# EasyEDA Pro project 灯板.eprj

# Schematic Schematic1
Create Date: 2024-07-11; Page Name: P1; Project Name: 灯板; Schematic Name: Schematic1; Update Date: 2024-07-11; Company: 嘉立创EDA; Page Size: A4; Version: V1.0
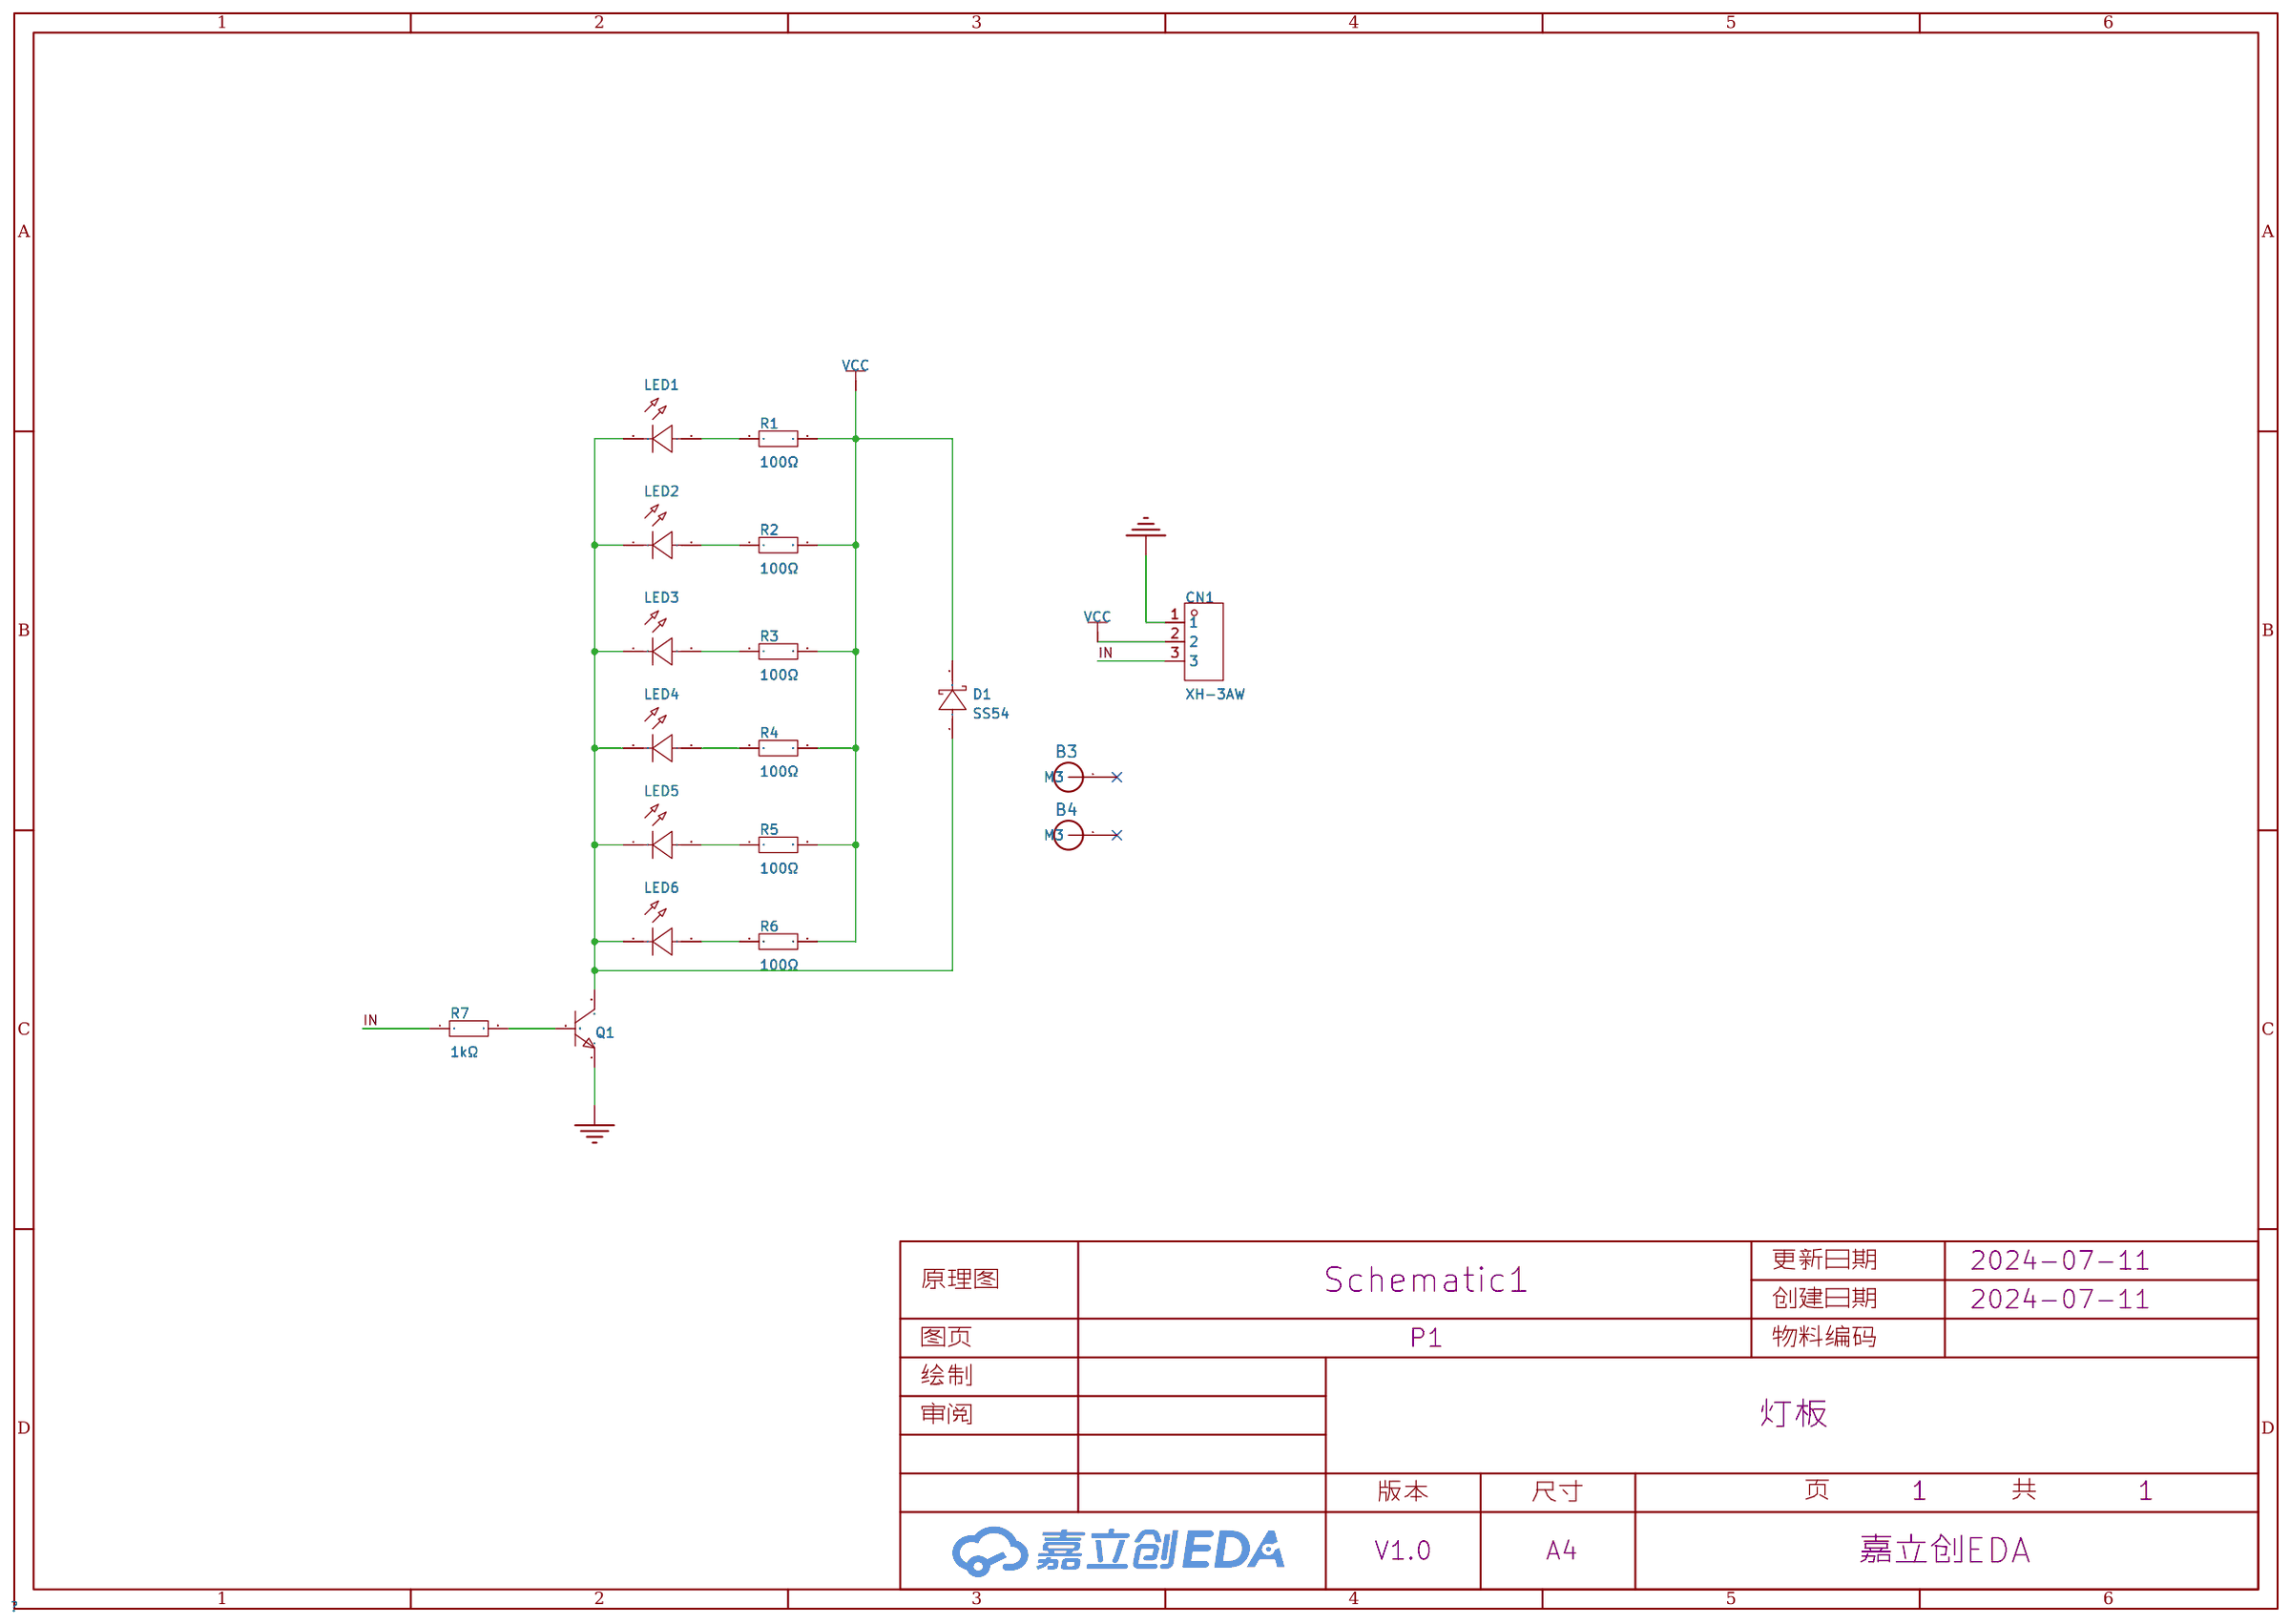
[diagram p0: schematic sheet]

## Parts
B3  M3螺柱孔_JX  [M3]
B4  M3螺柱孔_JX  [M3]
CN1  XH-3AW  [CONN-TH_3P-P2.54_HCTL_XH-3AW]
D1  SS54  [SMA_L4.3-W2.6-LS5.0-FD]
LED1  HL-A-3528H343W-S1-13HL-HR3(SDCM  [LED-SMD_L3.2-W2.8-LS3.5-RD_WHITE]
LED2  HL-A-3528H343W-S1-13HL-HR3(SDCM  [LED-SMD_L3.2-W2.8-LS3.5-RD_WHITE]
LED3  HL-A-3528H343W-S1-13HL-HR3(SDCM  [LED-SMD_L3.2-W2.8-LS3.5-RD_WHITE]
LED4  HL-A-3528H343W-S1-13HL-HR3(SDCM  [LED-SMD_L3.2-W2.8-LS3.5-RD_WHITE]
LED5  HL-A-3528H343W-S1-13HL-HR3(SDCM  [LED-SMD_L3.2-W2.8-LS3.5-RD_WHITE]
LED6  HL-A-3528H343W-S1-13HL-HR3(SDCM  [LED-SMD_L3.2-W2.8-LS3.5-RD_WHITE]
Q1  PBSS4350X,115  [SOT-89-3_L4.5-W2.5-P1.50-LS4.0-TR]
R1  100Ω  [R0603]
R2  100Ω  [R0603]
R3  100Ω  [R0603]
R4  100Ω  [R0603]
R5  100Ω  [R0603]
R6  100Ω  [R0603]
R7  1kΩ  [R0603]

## Library data of the parts
B3 B4 = M3螺柱孔_JX
CN1 = XH-3AW_C2908612: 插针结构:1x3P;间距:2.54mm;安装方式:弯插;参考系列:XH;总PIN数:3P;排数:1;每排PIN数:3;行距:-;额定电流:3A;触头材质:黄铜;触头镀层:锡;工作温度范围:-25℃~+85℃;; LCSC Part Name: 1x3P 间距:2.54mm 弯插 系列:XH; Supplier Part: C2908612; Manufacturer: HCTL(华灿天禄); Supplier Footprint: 弯插,P=2.54mm; JLCPCB Part Class: 扩展库; Datasheet: https://atta.szlcsc.com/upload/public/pdf/source/20230711/B565BAF3B11666EF6B81B3605408F2BD.pdf; Supplier: LCSC; Pins Structure: 1x3P; Pitch: 2.54mm; Mounting Style: 弯插; Reference Series: XH; Number of Pins: 3P; Number of Rows: 1; Number of PINs Per Row: 3; Current Rating (Max): 3A; Contact Material: 黄铜; Contact Plating: 锡; Operating Temperature Range: -25℃~+85℃
D1 = SS54_C7420369: 二极管配置:独立式;正向压降(Vf):550mV@5.0A;直流反向耐压(Vr):40V;平均整流电流(Io):5A;; LCSC Part Name: 电压:40V 电流:5A; Supplier Part: C7420369; Manufacturer: 宏迦橙; Supplier Footprint: SMA(DO-214AC); JLCPCB Part Class: 扩展库; Datasheet: https://atta.szlcsc.com/upload/public/pdf/source/20230828/254C3882F8647358AD9F60DD73611B5E.pdf; Supplier: LCSC; Diode Configuration: 独立式; Forward Voltage (Vf@If): 550mV@5.0A; Reverse Voltage (Vr): 40V; Average Rectified Current (Io): 5A; Reverse Leakage Current (Ir): 50uA@40V; Peak forward surge current: 120A
LED1-LED6 = HL-A-3528H343W-S1-13HL-HR3(SDCM_C516297: 发光颜色:白色;正向电压(VF):3.2V;功率:96mW;正向电流:20mA;主波长:-;透镜颜色:雾状黄透镜;色温:5000K;发光角度:120°;载带方式:正贴;工作温度:-40℃~+85℃;; LCSC Part Name: 白灯 正贴 色温5000K; Supplier Part: C516297; Manufacturer: HONGLITRONIC(鸿利光电); Supplier Footprint: SMD3528; JLCPCB Part Class: 扩展库; Datasheet: https://atta.szlcsc.com/upload/public/pdf/source/20200909/C516297_F1BF49F1CA56F4CAC6EC1E874BCCBE66.pdf; Supplier: LCSC; Emitted Color: 白色; Forward Voltage (VF): 3.2V; Power Dissipation: 96mW; Forward Current: 20mA; Lens Color: 雾状黄透镜; Color Temperature: 5000K; Viewing Angle: 120°; Mounting Sytle: 正贴; Operating Temperature: -40℃~+85℃
Q1 = PBSS4350X,115: 晶体管类型:NPN;集电极电流(Ic):3A;集射极击穿电压(Vceo):50V;功率(Pd):1.6W;直流电流增益(hFE@Ic,Vce):300@1A,2V;; LCSC Part Name: NPN 电流:3A 耐压:50V; Supplier Part: C135818; Manufacturer: Nexperia(安世); Supplier Footprint: SOT-89-3; JLCPCB Part Class: 扩展库; Datasheet: https://atta.szlcsc.com/upload/public/pdf/source/20200310/C493581_4E10D9A4C69822D153923FC65F749D7B.pdf; Supplier: LCSC; Transistor Type: NPN; Collector Current (Ic): 3A; Collector-Emitter Breakdown Voltage (Vceo): 50V; Power Dissipation (Pd): 1.6W; DC Current Gain (hFE@Ic,Vce): 300@1A,2V; Transition Frequency (fT): 100MHz; Collector Cut-Off Current (Icbo): 100nA; Collector-Emitter Saturation Voltage (VCE(sat)@Ic,Ib): 370mV@3A,300mA
R1-R6 = RC0603FR-07100RL: 电阻类型:厚膜电阻;阻值:100Ω;精度:±1%;功率:100mW;最大工作电压:75V;温度系数:±100ppm/℃;; LCSC Part Name: 厚膜电阻 100Ω ±1% 100mW; Supplier Part: C105588; Manufacturer: YAGEO(国巨); Supplier Footprint: 0603; JLCPCB Part Class: Extended Part; Datasheet: https://atta.szlcsc.com/upload/public/pdf/source/20180316/70C0E2BDAE7FCC62C531A5A58D202EE1.pdf; Supplier: LCSC; Type: 厚膜电阻; Tolerance: ±1%; Power(Watts): 100mW; Overload Voltage (Max): 75V; Temperature Coefficient: ±100ppm/℃; Operating Temperature Range: -55℃~+155℃
R7 = 0603WAF1001T5E: 电阻类型:厚膜电阻;阻值:1kΩ;精度:±1%;功率:100mW;; LCSC Part Name: 1kΩ ±1% 100mW; Supplier Part: C21190; Manufacturer: UNI-ROYAL(厚声); Supplier Footprint: 0603; JLCPCB Part Class: Basic Part; Datasheet: https://atta.szlcsc.com/upload/public/pdf/source/20200306/C422600_1E6D84923E4A46A82E41ADD87F860B5C.pdf; Supplier: LCSC; Type: 厚膜电阻; Tolerance: ±1%; Power(Watts): 100mW; Temperature Coefficient: ±100ppm/℃; Overload Voltage (Max): 75V; Operating Temperature Range: -55℃~+155℃

## Nets
GND: CN1.1 Q1.1(E)
VCC: CN1.2 D1.2(K) R1.2 R2.2 R3.2 R4.2 R5.2 R6.2
IN: CN1.3 R7.1
$1N1395: LED1.2(A) R1.1
$1N1398: LED2.2(A) R2.1
$1N1401: LED3.2(A) R3.1
$1N1404: LED4.2(A) R4.1
$1N1407: LED5.2(A) R5.1
$1N1410: LED6.2(A) R6.1
$1N1980: Q1.3(B) R7.2
$1N2010: D1.1(A) LED1.1(K) LED2.1(K) LED3.1(K) LED4.1(K) LED5.1(K) LED6.1(K) Q1.2(C)

Not connected (* = marked no-connect by the designer): B3 1(M3)*; B4 1(M3)*

# Board PCB1
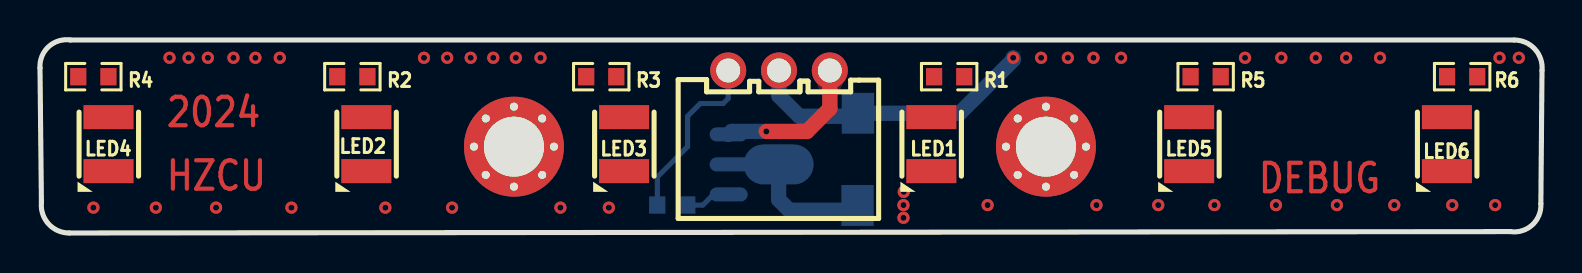
[diagram p1: board, top side]
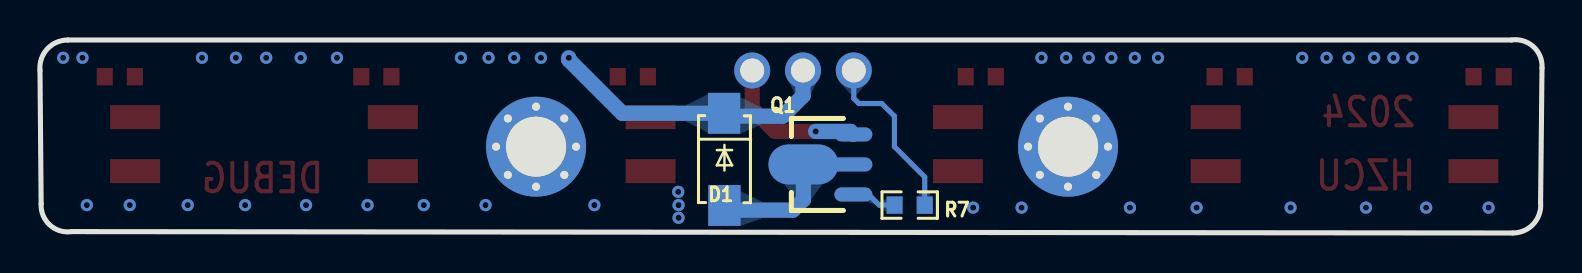
[diagram p2: board, bottom side, seen from below]

Outline 75.11 x 9.65 mm; copper layers: Top Layer, Bottom Layer. Coordinates in mm from the lower left corner of the outline.
Outline path: 0,8.25 0.07,1.52 arc(0.43,0.45) 1.47,0 73.53,0.07 arc(74.63,0.4) 75.06,1.47 75.11,8.12 arc(74.75,9.2) 73.72,9.65 1.52,9.65 arc(0.43,9.32) 0,8.25
Stack: Top Layer 0.035mm / Dielectric1 1.51mm FR4 er 4.5 / Bottom Layer 0.035mm

## Design rules (mm)
template: 自定义配置
spacing copperThickness1oz (default): track to track 0.102, other pairs 0.152 to 0.3
spacing copperThickness2oz: track to track 0.203, other pairs 0.152 to 0.3
track width copperThickness1oz (default): min 0.127, default 0.254, max 2.54
track width copperThickness2oz: min 0.203, default 0.254, max 2.54
differential pair differentialPair (default): width min 0.127, default 0.254, max 2.54; gap min 0.152, default 0.152
via viaSize (default): diameter min 0.5, default 0.61, max 10; hole min 0.3, default 0.305, max 6.3

## Placement (name value [footprint] x y rotation side)
B3  M3螺柱孔_JX  [M3]  50.31 4.32 0 top
B4  M3螺柱孔_JX  [M3]  23.7 4.32 0 top
CN1  XH-3AW  [CONN-TH_3P-P2.54_HCTL_XH-3AW]  36.96 8.13 180 top
D1  SS54  [SMA_L4.3-W2.6-LS5.0-FD]  40.89 3.68 90 bottom
LED1  HL-A-3528H343W-S1-13HL-HR3(SDCM  [LED-SMD_L3.2-W2.8-LS3.5-RD_WHITE]  44.58 4.44 270 top
LED2  HL-A-3528H343W-S1-13HL-HR3(SDCM  [LED-SMD_L3.2-W2.8-LS3.5-RD_WHITE]  16.32 4.44 270 top
LED3  HL-A-3528H343W-S1-13HL-HR3(SDCM  [LED-SMD_L3.2-W2.8-LS3.5-RD_WHITE]  29.21 4.44 270 top
LED4  HL-A-3528H343W-S1-13HL-HR3(SDCM  [LED-SMD_L3.2-W2.8-LS3.5-RD_WHITE]  3.43 4.44 270 top
LED5  HL-A-3528H343W-S1-13HL-HR3(SDCM  [LED-SMD_L3.2-W2.8-LS3.5-RD_WHITE]  57.47 4.44 270 top
LED6  HL-A-3528H343W-S1-13HL-HR3(SDCM  [LED-SMD_L3.2-W2.8-LS3.5-RD_WHITE]  70.36 4.44 270 top
Q1  PBSS4350X,115  [SOT-89-3_L4.5-W2.5-P1.50-LS4.0-TR]  35.69 3.43 180 bottom
R1  100Ω  [R0603]  45.47 7.82 0 top
R2  100Ω  [R0603]  15.62 7.82 180 top
R3  100Ω  [R0603]  28.07 7.82 180 top
R4  100Ω  [R0603]  2.67 7.82 180 top
R5  100Ω  [R0603]  58.29 7.82 0 top
R6  100Ω  [R0603]  71.12 7.82 0 top
R7  1kΩ  [R0603]  31.62 1.4 0 bottom

## Footprints (pads in the part's own frame, mm; a bottom-side part is the same pattern mirrored in y, then rotated)
CONN-TH_3P-P2.54_HCTL_XH-3AW
  round 1.8 hole 1.199: 1(-2.54,0) 2(0.002,0) 3(2.54,0)
LED-SMD_L3.2-W2.8-LS3.5-RD_WHITE
  rect 1.2x2.5 smd: 1(1.35,0) 2(-1.35,0)
M3
  round 0.6 hole 0.405x0.4: 1(-2,0) 1(-1.41,1.409) 1(-1.41,-1.41) 1(0,2) 1(0,-2) 1(1.41,1.409) 1(1.41,-1.41) 1(2,0)
  round 5 hole 3.005x3: 1(0,0)
R0603
  rect 0.806x0.864 smd: 1(-0.753,0) 2(0.753,0)
SMA_L4.3-W2.6-LS5.0-FD
  rect 2.046x1.62 smd: 1(-2.304,-0.009) 2(2.304,0.009)
SOT-89-3_L4.5-W2.5-P1.50-LS4.0-TR
  oval 1.9x0.7 smd: 1(1.25,1.501) 3(1.25,-1.501)
  oval 3.5x2 smd: 2(-1.25,0)
  oval 2.1x0.7 smd: 2(1.151,0)

## Nets
As in the schematic.

Pads without a net: B3 1; B4 1

## Via types
v1: diameter 0.61, hole 0.305, Top Layer to Bottom Layer, 45 vias

## Routing (per net, layer and track width the routed paths; a pad name or vN(x,y) marks a point on that pad's centre or on a via; arc(x,y) is an arc through that point)
GND: length 7.5
  Top Layer w0.762: CN1.1 39.5,6.22 38.35,5.08 v1(36.32,5.08)
  Bottom Layer w0.762: Q1.1 34.59,5.08 v1(36.32,5.08)
VCC: length 14.7
  Bottom Layer w0.762: v1(48.67,8.76) 48.67,8.66 45.99,5.99 D1.2 40.76,5.84 37.97,5.84 36.96,6.86 CN1.2
  vias: v1(6.48,8.76) v1(7.43,8.76) v1(8.39,8.76) v1(9.67,8.76) v1(10.77,8.76) v1(11.99,8.76) v1(19.2,8.76) v1(20.36,8.76) v1(21.54,8.76) v1(22.67,8.76) v1(23.8,8.76) v1(25.03,8.76) v1(50.06,8.76) v1(51.4,8.76) v1(52.68,8.76) v1(54.06,8.76) v1(60.26,8.76) v1(62.08,8.76) v1(63.8,8.76) v1(65.32,8.76) v1(67.01,8.76) v1(72.99,8.76) v1(73.95,8.76)
IN: length 8.9
  Bottom Layer w0.254: CN1.3 34.42,6.73 34.16,6.48 33.02,6.48 32.38,5.84 32.38,4.32 30.87,2.8 R7.1
$1N1980: length 2.3
  Bottom Layer w0.254: Q1.3 33.68,1.93 33.15,1.4 R7.2
$1N2010: length 6
  Bottom Layer w0.762: D1.1 40.65,1.14 37.47,1.14 36.94,1.67 Q1.2
  vias: v1(2.67,1.27) v1(5.79,1.27) v1(8.8,1.27) v1(12.57,1.27) v1(17.27,1.27) v1(20.61,1.27) v1(26.03,1.27) v1(28.45,1.27) v1(43.2,2.06) v1(43.18,1.4) v1(43.18,0.76) v1(47.39,1.4) v1(52.83,1.4) v1(55.92,1.4) v1(58.73,1.4) v1(61.81,1.4) v1(64.86,1.4) v1(67.73,1.4) v1(70.62,1.4) v1(72.77,1.4)

## Copper pours and planes (outline as drawn; the poured copper is in the pictures)
VCC on Top Layer: -1.02,10.54 76.07,10.54 76.07,4.19 -1.02,4.19
$1N1395 on Top Layer: 43.69,8.63 45.24,8.63 45.24,6.66 46.31,6.66 46.31,4.81 42.97,4.81 42.97,6.6 43.68,6.6 43.69,6.6
$1N1398 on Top Layer: 15.62,8.43 17.01,8.43 17.01,6.59 18.15,6.59 18.15,4.93 14.5,4.93 14.5,6.54 15.62,6.54
$1N1401 on Top Layer: 28.07,8.46 29.77,8.46 29.77,6.73 31.16,6.73 31.16,4.85 27.31,4.85 27.31,6.44 28.03,6.44 28.07,6.48
$1N1404 on Top Layer: 3.09,8.48 4.34,8.48 4.34,6.59 4.93,6.59 4.93,4.72 1.95,4.72 1.95,6.52 2.84,6.52 2.84,8.48 3.09,8.48
$1N1407 on Top Layer: 56.64,8.76 58.17,8.76 58.17,6.82 58.97,6.82 59.06,6.73 59.06,4.95 58.93,4.82 55.99,4.82 55.99,6.69 56.65,6.69 56.65,8.76
$1N1410 on Top Layer: 69.47,8.89 70.87,8.89 70.87,6.61 71.94,6.61 71.94,4.77 68.71,4.77 68.71,6.52 69.39,6.52 69.47,6.6
$1N2010 on Top Layer: -1.02,3.94 76.33,3.94 76.33,-0.51 -1.02,-0.51
$1N2010 on Bottom Layer: 39.37,2.41 43.76,2.41 43.76,0.23 39.37,0.23

Small or netless copper shapes (teardrops, artwork), in the pictures only: 1 on Top Layer, 9 on Bottom Layer

## Text on the board
Top Layer: 2024 | HZCU | DEBUG
Top Solder Mask Layer: 2024 | HZCU | DEBUG
